# EAGLE schematic trackuino-avr (EAGLE 5.08)
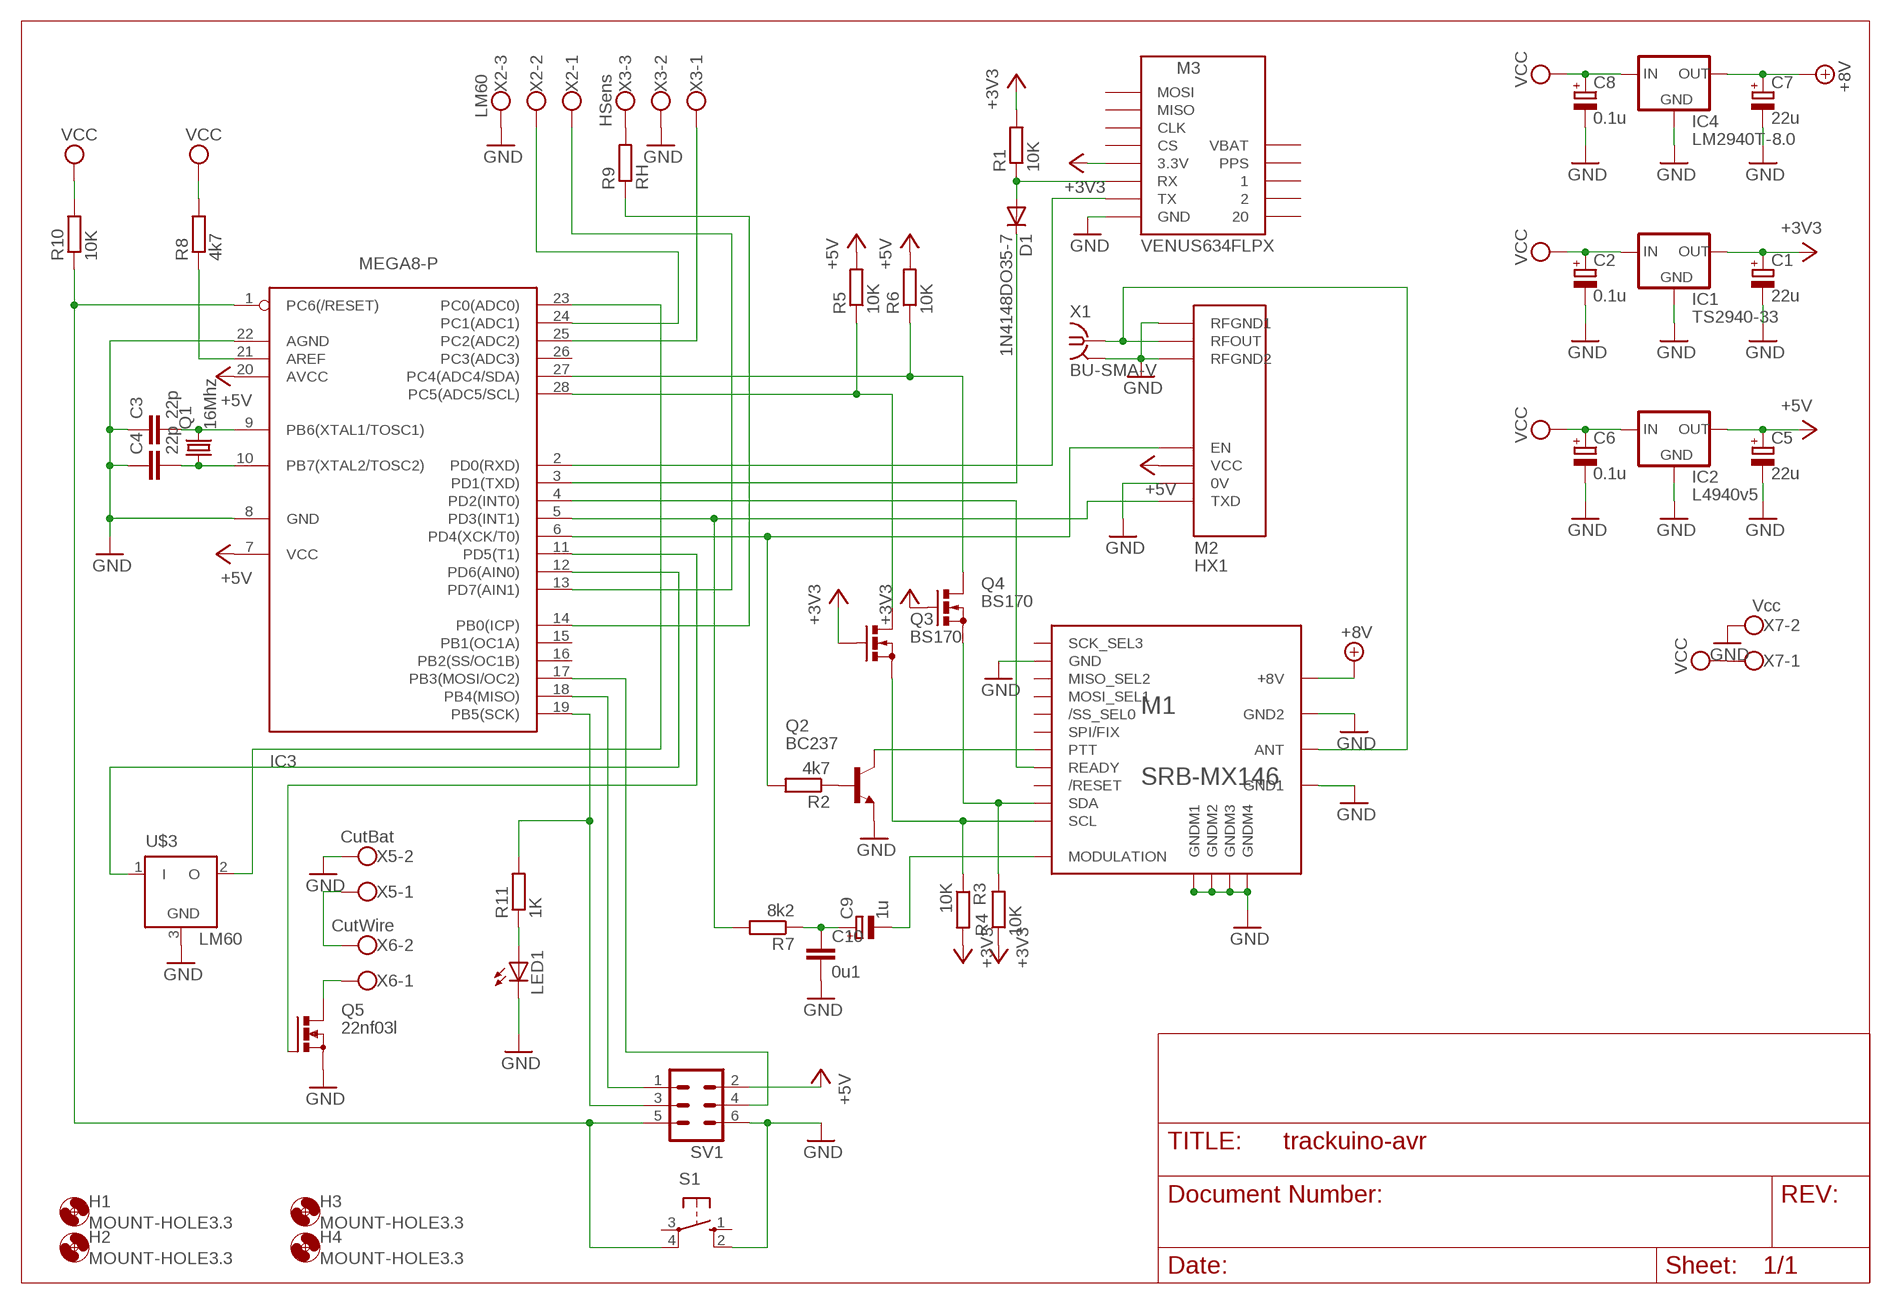
[diagram p0: schematic, sheet 1]

## Parts
C1  22u  CPOL-EUE2.5-5  [E2,5-5]
C2  0.1u  CPOL-EUE2.5-5  [E2,5-5]
C3  22p  C-EU025-025X050  [C025-025X050]
C4  22p  C-EU025-025X050  [C025-025X050]
C5  22u  CPOL-EUE2.5-5  [E2,5-5]
C6  0.1u  CPOL-EUE2.5-5  [E2,5-5]
C7  22u  CPOL-EUE2.5-5  [E2,5-5]
C8  0.1u  CPOL-EUE2.5-5  [E2,5-5]
C9  1u  CPOL-EUE2.5-5  [E2,5-5]
C10  0u1  C-EU025-025X050  [C025-025X050]
D1  1N4148DO35-7  [DO35-7]
H1  MOUNT-HOLE3.3  [3,3]
H2  MOUNT-HOLE3.3  [3,3]
H3  MOUNT-HOLE3.3  [3,3]
H4  MOUNT-HOLE3.3  [3,3]
IC1  TS2940-33  78XXL  [78XXL]
IC2  L4940v5  78XXL  [78XXL]
IC3  MEGA8-P  [DIL28-3]
IC4  LM2940T-8.0  78XXL  [78XXL]
LED1  LED3MM  [LED3MM]
M1  SRB-MX146  [SRB-MX146]
M2  HX1  [HX1]
M3  VENUS634FLPX  [VENUS634FLPX]
Q1  16Mhz  CRYSTALHC49S  [HC49/S]
Q2  BC237  [TO92]
Q3  BS170  [SOT54E]
Q4  BS170  [SOT54E]
Q5  22nf03l  PMOSFET_NTO220BH  [TO220BH]
R1  10K  R-EU_0204/5  [0204/5]
R2  4k7  R-EU_0204/5  [0204/5]
R3  10K  R-EU_0204/5  [0204/5]
R4  10K  R-EU_0204/5  [0204/5]
R5  10K  R-EU_0204/5  [0204/5]
R6  10K  R-EU_0204/5  [0204/5]
R7  8k2  R-EU_0204/5  [0204/5]
R8  4k7  R-EU_0204/5  [0204/5]
R9  RH  R-EU_0204/5  [0204/5]
R10  10K  R-EU_0204/5  [0204/5]
R11  1K  R-EU_0204/5  [0204/5]
S1  10-XX  [B3F-10XX]
SV1  MA03-2  [MA03-2]
U$3  LM60  [TO92]
X1  BU-SMA-V  [BU-SMA-V]
X2  LM60  W237-103  [W237-103]
X3  HSens  W237-103  [W237-103]
X5  CutBat  W237-102  [W237-102]
X6  CutWire  W237-102  [W237-102]
X7  Vcc  W237-102  [W237-102]

## Nets
+3V3: C1.+ IC1.OUT M3.3.3V Q3.G Q4.G R1.2 R3.2 R4.1
+5V: C5.+ IC2.OUT IC3.7(VCC) IC3.20(AVCC) M2.VCC R5.2 R6.2 SV1.2
+8V: C7.+ IC4.OUT M1.+8V
GND: C1.- C2.- C3.1 C4.1 C5.- C6.- C7.- C8.- C10.2 IC1.GND IC2.GND IC3.8(GND) IC3.22(AGND) IC4.GND LED1.K(C) M1.GND M1.GND1 M1.GND2 M1.GNDM1 M1.GNDM2 M1.GNDM3 M1.GNDM4 M2.0V M2.RFGND1 M2.RFGND2 M3.GND Q2.1(E) Q5.S S1.2(S1) SV1.6 U$3.3(GND) X1.2(GND) X2.3 X3.2 X5.2 X7.2
N$1: IC3.21(AREF) R8.1
N$2: M1.ANT M2.RFOUT X1.1
N$3: C3.2 IC3.9(PB6(XTAL1/TOSC1)) Q1.2
N$4: C4.2 IC3.10(PB7(XTAL2/TOSC2)) Q1.1
N$5: IC3.4(PD2(INT0)) M1.PRE2(READY)
N$6: IC3.5(PD3(INT1)) M2.TXD R7.2
N$7: IC3.6(PD4(XCK/T0)) M2.EN R2.2
N$8: IC3.12(PD6(AIN0)) U$3.1(I)
N$9: IC3.2(PD0(RXD)) M3.TX
N$10: D1.C IC3.3(PD1(TXD))
N$11: D1.A M3.RX R1.1
N$12: IC3.14(PB0(ICP)) R9.1
N$13: C9.+ C10.1 R7.1
N$14: Q2.2(B) R2.1
N$15: M1.PRE1(PTT) Q2.3(C)
N$16: M1.SDA Q4.S R4.2
N$17: IC3.27(PC4(ADC4/SDA)) Q4.D R6.1
N$18: IC3.28(PC5(ADC5/SCL)) Q3.D R5.1
N$19: M1.SCL Q3.S R3.1
N$20: C9.- M1.MOD(MODULATION)
N$21: R9.2 X3.3
N$22: IC3.11(PD5(T1)) Q5.G
N$23: X5.1 X6.2
N$24: Q5.D X6.1
N$25: IC3.23(PC0(ADC0)) U$3.2(O)
N$26: IC3.13(PD7(AIN1)) X2.1
N$27: IC3.24(PC1(ADC1)) X2.2
N$28: IC3.25(PC2(ADC2)) X3.1
N$29: IC3.18(PB4(MISO)) SV1.1
N$30: IC3.19(PB5(SCK)) R11.2 SV1.3
N$31: IC3.17(PB3(MOSI/OC2)) SV1.4
N$32: IC3.1(PC6(/RESET)) R10.1 S1.4(P1) SV1.5
N$33: LED1.A R11.1
VCC: C2.+ C6.+ C8.+ IC1.IN IC2.IN IC4.IN R8.2 R10.2 X7.1
Unconnected: IC3.15(PB1(OC1A)) IC3.16(PB2(SS/OC1B)) IC3.26(PC3(ADC3)) M1./RES(/RESET) M1./SS(/SS_SEL0) M1.MISO(MISO_SEL2) M1.MOSI(MOSI_SEL1) M1.PRE0(SPI/FIX) M1.SCK(SCK_SEL3) M3.1 M3.2 M3.20 M3.CLK M3.CS M3.MISO M3.MOSI M3.PPS M3.VBAT S1.1(S) S1.3(P)

## Power pins joined to a net without a drawn wire
GND: X1.3(GND) X1.4(GND) X1.5(GND)

## Library data of the parts
C1 C2 C5-C9 = rcl:CPOL-EU: POLARIZED CAPACITOR, European symbol
C3 C4 C10 = rcl:C-EU: CAPACITOR, European symbol
D1 = diode:1N4148: DIODE high speed (Philips)
H1-H4 = holes:MOUNT-HOLE: MOUNTING HOLE with drill center marker
IC1 IC2 IC4 = v-reg:78XXL: VOLTAGE REGULATOR
IC3 = avr-6:MEGA8-P: MICROCONTROLLER 8 Kbytes FLASH 1 kbytes SRAM 512 bytes EEPROM USART 4-channel 10 bit ADC 2-channel 8 bit ADC
LED1 = led:LED: LED OSRAM: - CHIPLED LG R971, LG N971, LY N971, LG Q971, LY Q971, LO R971, LY R971 LH N974, LH R974 LS Q976, LO Q976, LY Q976 LO Q996 - Hyper CHIPLED LW Q18S LB Q993, LB Q99A, LB R99A - SideLED LS A670, LO A670, LY A670, LG A670, LP A670 LB A673, LV A673, LT A673, LW A673 LH A674 LY A675 LS A676, LA A676, LO A676, LY A676, LW A676 LS A679, LY A679, LG A679 - Hyper Micro SIDELED® LS Y876, LA Y876, LO Y876, LY Y876 LT Y87S - SmartLED LW L88C, LW L88S LB L89C, LB L89S, LG L890 LS L89K, LO L89K, LY L89K LS L896, LA L896, LO L896, LY L896 - TOPLED LS T670, LO T670, LY T670, LG T670, LP T670 LSG T670, LSP T670, LSY T670, LOP T670, LYG T670 LG T671, LOG T671, LSG T671 LB T673, LV T673, LT T673, LW T673 LH T674 LS T676, LA T676, LO T676, LY T676, LB T676, LH T676, LSB T676, LW T676 LB T67C, LV T67C, LT T67C, LS T67K, LO T67K, LY T67K, LW E67C LS E67B, LA E67B, LO E67B, LY E67B, LB E67C, LV E67C, LT E67C LW T67C LS T679, LY T679, LG T679 LS T770, LO T770, LY T770, LG T770, LP T770 LB T773, LV T773, LT T773, LW T773 LH T774 LS E675, LA E675, LY E675, LS T675 LS T776, LA T776, LO T776, LY T776, LB T776 LHGB T686 LT T68C, LB T68C - Hyper Mini TOPLED® LB M676 - Mini TOPLED Santana® LG M470 LS M47K, LO M47K, LY M47K Source: http://www.osram.convergy.de LUXEON: - LUMILED® LXK2-PW12-R00, LXK2-PW12-S00, LXK2-PW14-U00, LXK2-PW14-V00 LXK2-PM12-R00, LXK2-PM12-S00, LXK2-PM14-U00 LXK2-PE12-Q00, LXK2-PE12-R00, LXK2-PE12-S00, LXK2-PE14-T00, LXK2-PE14-U00 LXK2-PB12-K00, LXK2-PB12-L00, LXK2-PB12-M00, LXK2-PB14-N00, LXK2-PB14-P00, LXK2-PB14-Q00 LXK2-PR12-L00, LXK2-PR12-M00, LXK2-PR14-Q00, LXK2-PR14-R00 LXK2-PD12-Q00, LXK2-PD12-R00, LXK2-PD12-S00 LXK2-PH12-R00, LXK2-PH12-S00 LXK2-PL12-P00, LXK2-PL12-Q00, LXK2-PL12-R00 Source: www.luxeon.com KINGBRIGHT: KA-3528ASYC Source: www.kingbright.com
M1 = SRB:SRB-MX146: 2m/VHF transmitter module
M2 = trackuino:HX1
M3 = trackuino:VENUS634FLPX
Q1 = crystal:CRYSTAL: CRYSTAL
Q2 = transistor-npn:BC237: NPN Transistor
Q3 Q4 = transistor-small-signal:BS170: N-CHANNEL MOS FET
Q5 = transistor-power:PMOSFET_N: Power MOSFET N-Channel
R1-R11 = rcl:R-EU_: RESISTOR, European symbol
S1 = switch-omron:10-XX: OMRON SWITCH
SV1 = con-lstb:MA03-2: PIN HEADER
U$3 = trackuino:LM60
X1 = con-coax:BU-SMA-V: FEMALE SMA CONNECTOR Radiall distributor RS 112-3794
X2 X3 = con-wago-500:W237-103: WAGO SCREW CLAMP
X5-X7 = con-wago-500:W237-102: WAGO SCREW CLAMP